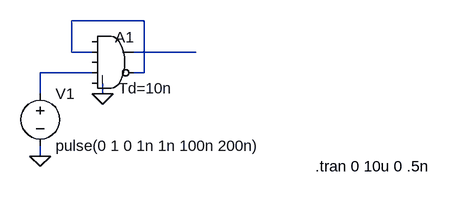
[diagram p0: schematic Ring2.asc]
Ring2.asc, the LTspice schematic file:
Version 4
SHEET 1 1248 680
WIRE 784 80 672 80
WIRE 672 128 672 80
WIRE 704 128 672 128
WIRE 864 128 768 128
WIRE 704 160 624 160
WIRE 784 160 784 80
WIRE 784 160 768 160
WIRE 624 192 624 160
WIRE 720 192 720 176
WIRE 624 288 624 272
FLAG 624 288 0
FLAG 720 192 0
SYMBOL digital\\and 736 80 R0
WINDOW 0 3 25 Left 0
WINDOW 3 9 104 Left 0
SYMATTR InstName A1
SYMATTR Value Td=10n
SYMATTR Value2 Trise=1n
SYMBOL voltage 624 176 R0
SYMATTR InstName V1
SYMATTR Value pulse(0 1 0 1n 1n 100n 200n)
TEXT 1048 304 Left 0 !.tran 0 10u 0 .5n

The netlist it stands for:
* Ring2.asc
A1 0 N001 0 N003 0 N001 N002 0 AND Td=10n Trise=1n
V1 N003 0 pulse(0 1 0 1n 1n 100n 200n)
.tran 0 10u 0 .5n
.backanno
.end